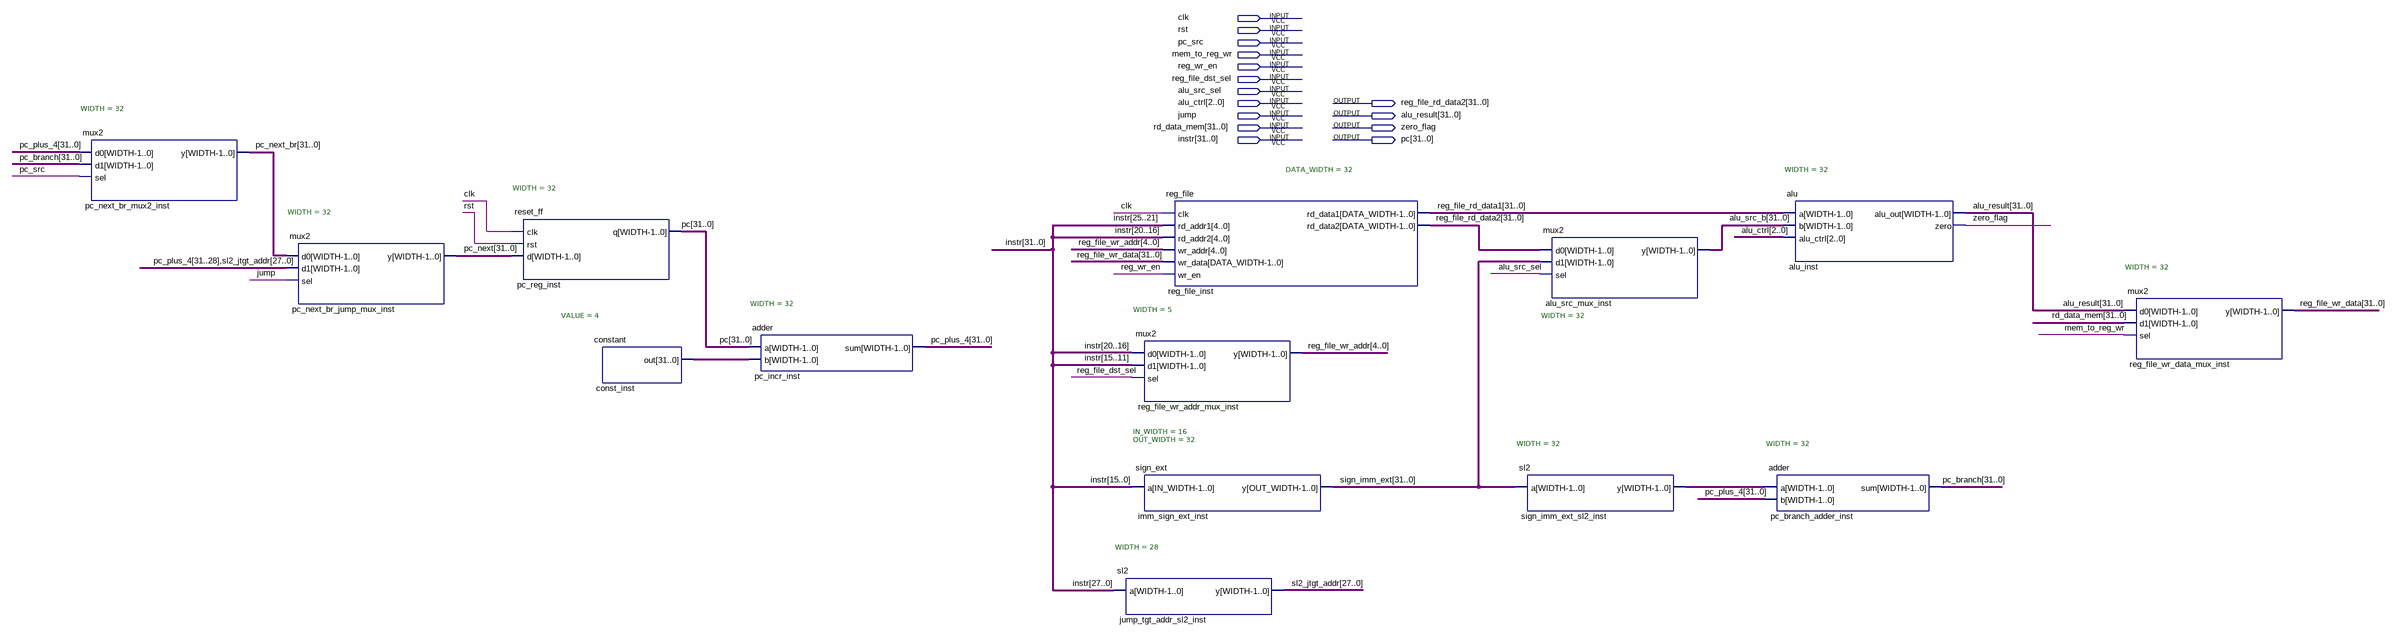
[diagram p0: schematic sheet]
// Quartus schematic datapath.bdf as structural Verilog: 14 symbols, 15 pins
module datapath (
  input  clk,
  input  rst,
  input  pc_src,
  input  mem_to_reg_wr,
  input  reg_wr_en,
  input  reg_file_dst_sel,
  input  alu_src_sel,
  input  [2:0] alu_ctrl,
  input  jump,
  input  [31:0] rd_data_mem,
  input  [31:0] instr,
  output [31:0] reg_file_rd_data2,
  output [31:0] alu_result,
  output zero_flag,
  output [31:0] pc
);

  wire [4:0] reg_file_wr_addr;
  wire [27:0] sl2_jtgt_addr;
  wire [31:0] alu_src_b, const_inst_out, pc_branch, pc_next, pc_next_br, pc_plus_4, reg_file_rd_data1,
       reg_file_wr_data, sign_imm_ext, sign_imm_ext_sl2_inst_y;

  mux2 #(.WIDTH(32)) pc_next_br_mux2_inst (.d0(pc_plus_4), .d1(pc_branch), .sel(pc_src), .y(pc_next_br));
  mux2 #(.WIDTH(32)) pc_next_br_jump_mux_inst (
    .d0(pc_next_br), .d1({pc_plus_4[31:28], sl2_jtgt_addr}), .sel(jump), .y(pc_next));
  reset_ff #(.WIDTH(32)) pc_reg_inst (.clk(clk), .rst(rst), .d(pc_next), .q(pc));
  constant #(.VALUE(4)) const_inst (.out(const_inst_out));
  adder #(.WIDTH(32)) pc_incr_inst (.a(pc), .b(const_inst_out), .sum(pc_plus_4));
  mux2 #(.WIDTH(5)) reg_file_wr_addr_mux_inst (
    .d0(instr[20:16]), .d1(instr[15:11]), .sel(reg_file_dst_sel), .y(reg_file_wr_addr));
  sign_ext #(.IN_WIDTH(16), .OUT_WIDTH(32)) imm_sign_ext_inst (.a(instr[15:0]), .y(sign_imm_ext));
  sl2 #(.WIDTH(28)) jump_tgt_addr_sl2_inst (.a(instr[27:0]), .y(sl2_jtgt_addr));
  reg_file #(.DATA_WIDTH(32)) reg_file_inst (
    .clk(clk), .rd_addr1(instr[25:21]), .rd_addr2(instr[20:16]), .wr_addr(reg_file_wr_addr),
    .wr_data(reg_file_wr_data), .wr_en(reg_wr_en), .rd_data1(reg_file_rd_data1), .rd_data2(reg_file_rd_data2));
  sl2 #(.WIDTH(32)) sign_imm_ext_sl2_inst (.a(sign_imm_ext), .y(sign_imm_ext_sl2_inst_y));
  mux2 #(.WIDTH(32)) alu_src_mux_inst (.d0(reg_file_rd_data2), .d1(sign_imm_ext), .sel(alu_src_sel), .y(alu_src_b));
  adder #(.WIDTH(32)) pc_branch_adder_inst (.a(sign_imm_ext_sl2_inst_y), .b(pc_plus_4), .sum(pc_branch));
  alu #(.WIDTH(32)) alu_inst (
    .a(reg_file_rd_data1), .b(alu_src_b), .alu_ctrl(alu_ctrl), .alu_out(alu_result), .zero(zero_flag));
  mux2 #(.WIDTH(32)) reg_file_wr_data_mux_inst (
    .d0(alu_result), .d1(rd_data_mem), .sel(mem_to_reg_wr), .y(reg_file_wr_data));
endmodule
